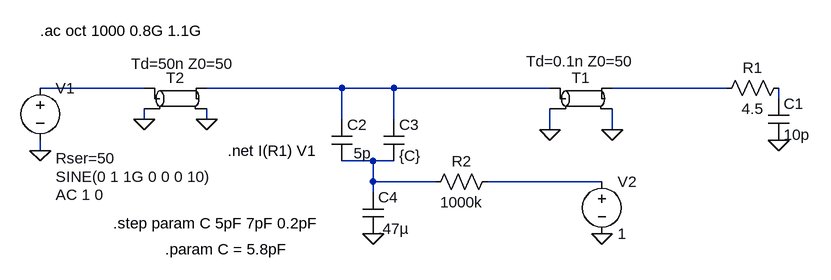
[diagram p0: schematic TunableMatching.asc]
TunableMatching.asc, the LTspice schematic file:
Version 4
SHEET 1 1848 680
WIRE -208 80 -368 80
WIRE 96 80 -112 80
WIRE 176 80 96 80
WIRE 416 80 176 80
WIRE 688 80 512 80
WIRE 768 96 768 80
WIRE -208 128 -208 112
WIRE -112 128 -112 112
WIRE 96 128 96 80
WIRE 176 128 176 80
WIRE 416 144 416 112
WIRE 512 144 512 112
WIRE -368 176 -368 160
WIRE 144 192 96 192
WIRE 176 192 144 192
WIRE 144 224 144 192
WIRE 240 224 144 224
WIRE 496 224 320 224
WIRE 144 240 144 224
FLAG -112 128 0
FLAG -368 176 0
FLAG 768 160 0
FLAG -208 128 0
FLAG 416 144 0
FLAG 512 144 0
FLAG 144 304 0
FLAG 496 304 0
SYMBOL voltage -368 64 R0
WINDOW 3 24 152 Left 2
WINDOW 123 24 180 Left 2
WINDOW 39 24 124 Left 2
SYMATTR Value SINE(0 1 1G 0 0 0 10)
SYMATTR Value2 AC 1 0
SYMATTR SpiceLine Rser=50
SYMATTR InstName V1
SYMBOL tline -160 96 R0
WINDOW 3 12 -69 Top 2
SYMATTR InstName T2
SYMBOL cap 752 96 R0
SYMATTR InstName C1
SYMATTR Value 10p
SYMBOL cap 80 128 R0
WINDOW 3 34 52 Left 2
SYMATTR InstName C2
SYMATTR Value 5p
SYMBOL tline 464 96 R0
WINDOW 3 -1 -73 Top 2
SYMATTR Value Td=0.1n Z0=50
SYMATTR InstName T1
SYMBOL res 784 64 R90
WINDOW 0 0 56 VBottom 2
WINDOW 3 32 56 VTop 2
SYMATTR InstName R1
SYMATTR Value 4.5
SYMBOL cap 160 128 R0
SYMATTR InstName C3
SYMATTR Value {C}
SYMBOL cap 128 240 R0
SYMATTR InstName C4
SYMATTR Value .47µ
SYMBOL res 336 208 R90
WINDOW 0 0 56 VBottom 2
WINDOW 3 32 56 VTop 2
SYMATTR InstName R2
SYMATTR Value 1000k
SYMBOL voltage 496 208 R0
WINDOW 123 0 0 Left 2
WINDOW 39 0 0 Left 2
SYMATTR InstName V2
SYMATTR Value 1
TEXT -368 -8 Left 2 !.ac oct 1000 0.8G 1.1G
TEXT -80 176 Left 2 !.net I(R1) V1
TEXT -176 328 Left 2 !.param C = 5.8pF
TEXT -256 288 Left 2 !.step param C 5pF 7pF 0.2pF

The netlist it stands for:
* TunableMatching.asc
V1 N001 0 SINE(0 1 1G 0 0 0 10) AC 1 0 Rser=50
T2 N001 0 N002 0 Td=50n Z0=50
C1 N004 0 10p
C2 N002 N005 5p
T1 N002 0 N003 0 Td=0.1n Z0=50
R1 N004 N003 4.5
C3 N002 N005 {C}
C4 N005 0 .47µ
R2 N006 N005 1000k
V2 N006 0 1
.ac oct 1000 0.8G 1.1G
.net I(R1) V1
.param C = 5.8pF
.step param C 5pF 7pF 0.2pF
.backanno
.end